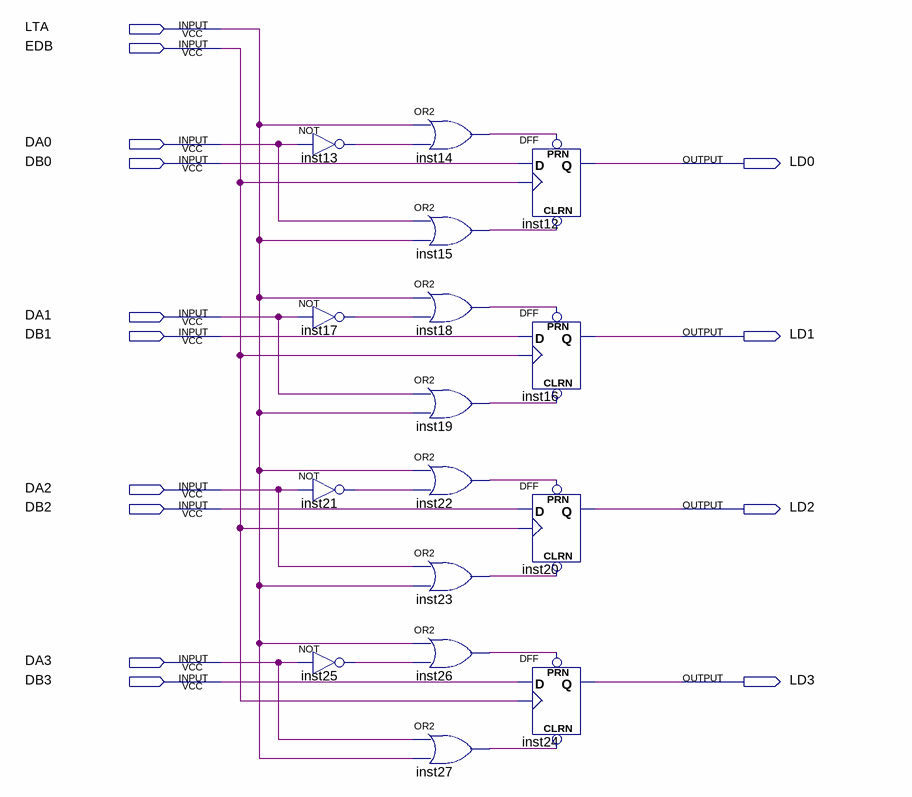
[diagram p0: schematic sheet]
// Quartus schematic 2buferlatchedge4b.bdf as structural Verilog: 16 symbols, 14 pins
module \2buferlatchedge4b  (
  input  LTA,
  input  EDB,
  input  DA0,
  input  DB0,
  input  DA1,
  input  DB1,
  input  DA2,
  input  DB2,
  input  DA3,
  input  DB3,
  output LD0,
  output LD1,
  output LD2,
  output LD3
);

  wire inst13_out, inst14_out, inst15_out, inst17_out, inst18_out, inst19_out, inst21_out, inst22_out,
       inst23_out, inst25_out, inst26_out, inst27_out;

  not inst13 (inst13_out, DA0);
  not inst17 (inst17_out, DA1);
  not inst21 (inst21_out, DA2);
  not inst25 (inst25_out, DA3);
  or inst14 (inst14_out, LTA, inst13_out);
  or inst15 (inst15_out, DA0, LTA);
  or inst18 (inst18_out, LTA, inst17_out);
  or inst19 (inst19_out, DA1, LTA);
  or inst22 (inst22_out, LTA, inst21_out);
  or inst23 (inst23_out, DA2, LTA);
  or inst26 (inst26_out, LTA, inst25_out);
  or inst27 (inst27_out, DA3, LTA);
  DFF inst12 (.CLRN(inst15_out), .CLK(EDB), .D(DB0), .PRN(inst14_out), .Q(LD0));
  DFF inst16 (.CLRN(inst19_out), .CLK(EDB), .D(DB1), .PRN(inst18_out), .Q(LD1));
  DFF inst20 (.CLRN(inst23_out), .CLK(EDB), .D(DB2), .PRN(inst22_out), .Q(LD2));
  DFF inst24 (.CLRN(inst27_out), .CLK(EDB), .D(DB3), .PRN(inst26_out), .Q(LD3));
endmodule
